# EAGLE design BackscatterPlantSensor_v2_test (EAGLE 6.4)

## Sheet 1 of 3
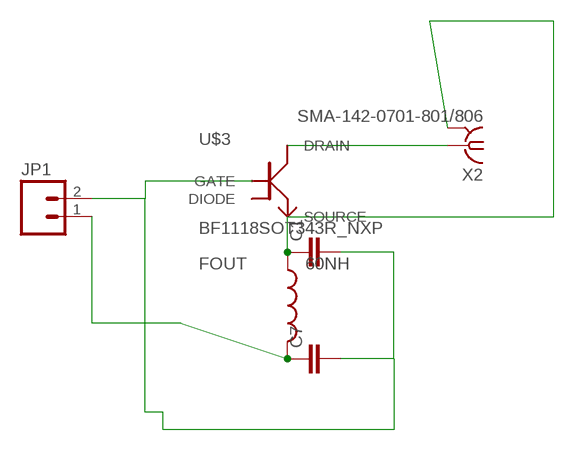
[diagram p0: schematic, sheet 1]

### Parts
60NH  INDUCTOR0402  [C0402]
C1  CAP0402-CAP  [0402-CAP]
C7  CAP0402-CAP  [0402-CAP]
JP1  M02PTH  [1X02]
U$3  BF1118SOT343R_NXP  [SOT343R]
X2  SMA-142-0701-801/806  [J502-ND-142-0701-801/806]

### Nets
DGND: C1.2 C7.2 JP1.2 U$3.1(GATE)
DRAIN: U$3.4(DRAIN) X2.1
FOUT: 60NH.2 C7.1 JP1.1
FOUT2: 60NH.1 C1.1 U$3.3(SOURCE) X2.G@1(GND)
Unconnected: U$3.2(DIODE)

## Sheet 2 of 3

## Sheet 3 of 3

## Power pins joined to a net without a drawn wire
GND: X2.G@2(GND) X2.G@3(GND) X2.G@4(GND)

## Library data of the parts
60NH = SparkFun:INDUCTOR: Inductors Basic Inductor/Choke - 0603 and 1206. Footprints are not proven and vary greatly between part numbers.
C1 C7 = SparkFun-Capacitors:CAP: Capacitor Standard 0603 ceramic capacitor, and 0.1" leaded capacitor.
JP1 = SparkFun-Connectors:M02: Header 2 Standard 2-pin 0.1" header. Use with straight break away headers (SKU : PRT-00116), right angle break away headers (PRT-00553), swiss pins (PRT-00743), machine pins (PRT-00117), and female headers (PRT-00115). Molex polarized connector foot print use with SKU : PRT-08233 with associated crimp pins and housings.
U$3 = rf_transistors:BF1118
X2 = con-coax:SMA-: SMA 50 Ohm End Launch Jack Receptacle - Round Contact Johnson Components Source: www.johnsoncomponents.com .. J502-ND.pdf; MF: JOHNSON COMPONENTS; MPN: 142-0701-801; OC_FARNELL: 1608592; OC_NEWARK: 90F2624

## Board
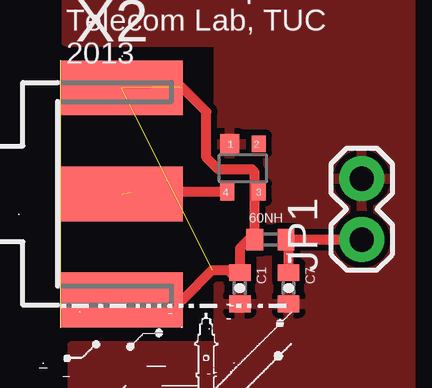
[diagram p1: board, top side]
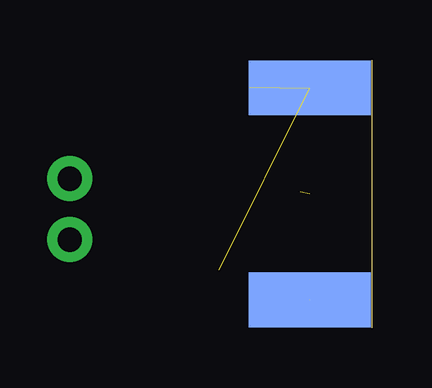
[diagram p2: board, bottom side, seen from below]

Size 0 x 11.18 mm. Coordinates in mm from the lower left corner, seen from the top.
Copper layers (1*16): Top 0.035mm / dielectric 1.5mm / Bottom 0.035mm
Design rules "Fusion_eagle_rule_v1.1 *": minimum track width 6mil, minimum drill 12mil, track to track 10mil, track to pad 10mil, pad to pad 10mil, via to via 10mil, smd to smd 0mil, copper to edge 10mil, drill to drill 10mil, minimum pad ring 10mil, minimum via ring 6mil, stop-mask expansion 2mil, vias tented up to drill 100mil, thermal gap 10mil

### Footprints (pad centres in the part's own frame; a part is rotated, then mirrored left to right if it is on the bottom)
C0402 = smd 0.7 x 0.9: 1 -0.65,0; 2 0.65,0
0402-CAP = smd 0.7 x 0.9: 1 -0.65,0; 2 0.65,0
1X02 = drill 1.016 pad 1.88: 1 0,0; 2 2.54,0
SOT343R = smd 0.8 x 0.8: 1 0.55,-1.07 | smd 0.6 x 0.7: 2 -0.66,-1.07; 3 -0.66,0.94; 4 0.65,0.94
J502-ND-142-0701-801/806 = smd 5.08 x 2.286: 1 2.565,0; G@1 2.565,4.42; G@2 2.565,-4.42 | smd 5.08 x 2.286 bottom: G@3 2.565,4.42; G@4 2.565,-4.42

### Placement (x,y rotation side)
60NH  8.76,3.68 0 top  (outside the outline)
C1  7.49,1.65 270 top  (outside the outline)
C7  9.53,1.65 270 top  (outside the outline)
JP1  12.57,3.68 90 top  (outside the outline)
U$3  7.62,6.6 180 top  (outside the outline)
X2  0,5.59 0 top

### Tracks (layer width: path | path; a pad name or v marks a point on that pad's centre or on a via)
DGND
  pour Top: 0.51,-0.76 0.51,-5.46 14.61,-5.46 14.61,15.88 0.25,15.88 0.25,11.94 6.6,11.94 6.6,-0.76
DRAIN  (1 unrouted)
  Top 0.406: U$3.4 2.97,5.66
FOUT
  Top 0.406: 60NH.2 9.54,3.58 | C7.1 9.53,3.68 60NH.2 | 60NH.2 JP1.1
FOUT2  (1 unrouted)
  Top 0.406: 8.11,5.58 60NH.1 7.87,3.68 7.49,3.3 C1.1 | 8.11,5.58 U$3.3 | 8.11,5.58 8.11,6.49 8,6.6 6.6,6.6 6.1,7.11 6.1,9.02 5.08,10.03
GND  (2 unrouted)
  Top 0.406: 7.49,2.41 7.24,2.16 6.98,2.41 6.35,2.41 5.11,1.17 X2.G@4

### Text on the board
tPlace: J. Kimionis / K. Tountas / E. Kampianakis / C. Konstantopoulos / Telecom Lab, TUC / 2013